# EAGLE design RH025_V2.1 (EAGLE 7.6.0)
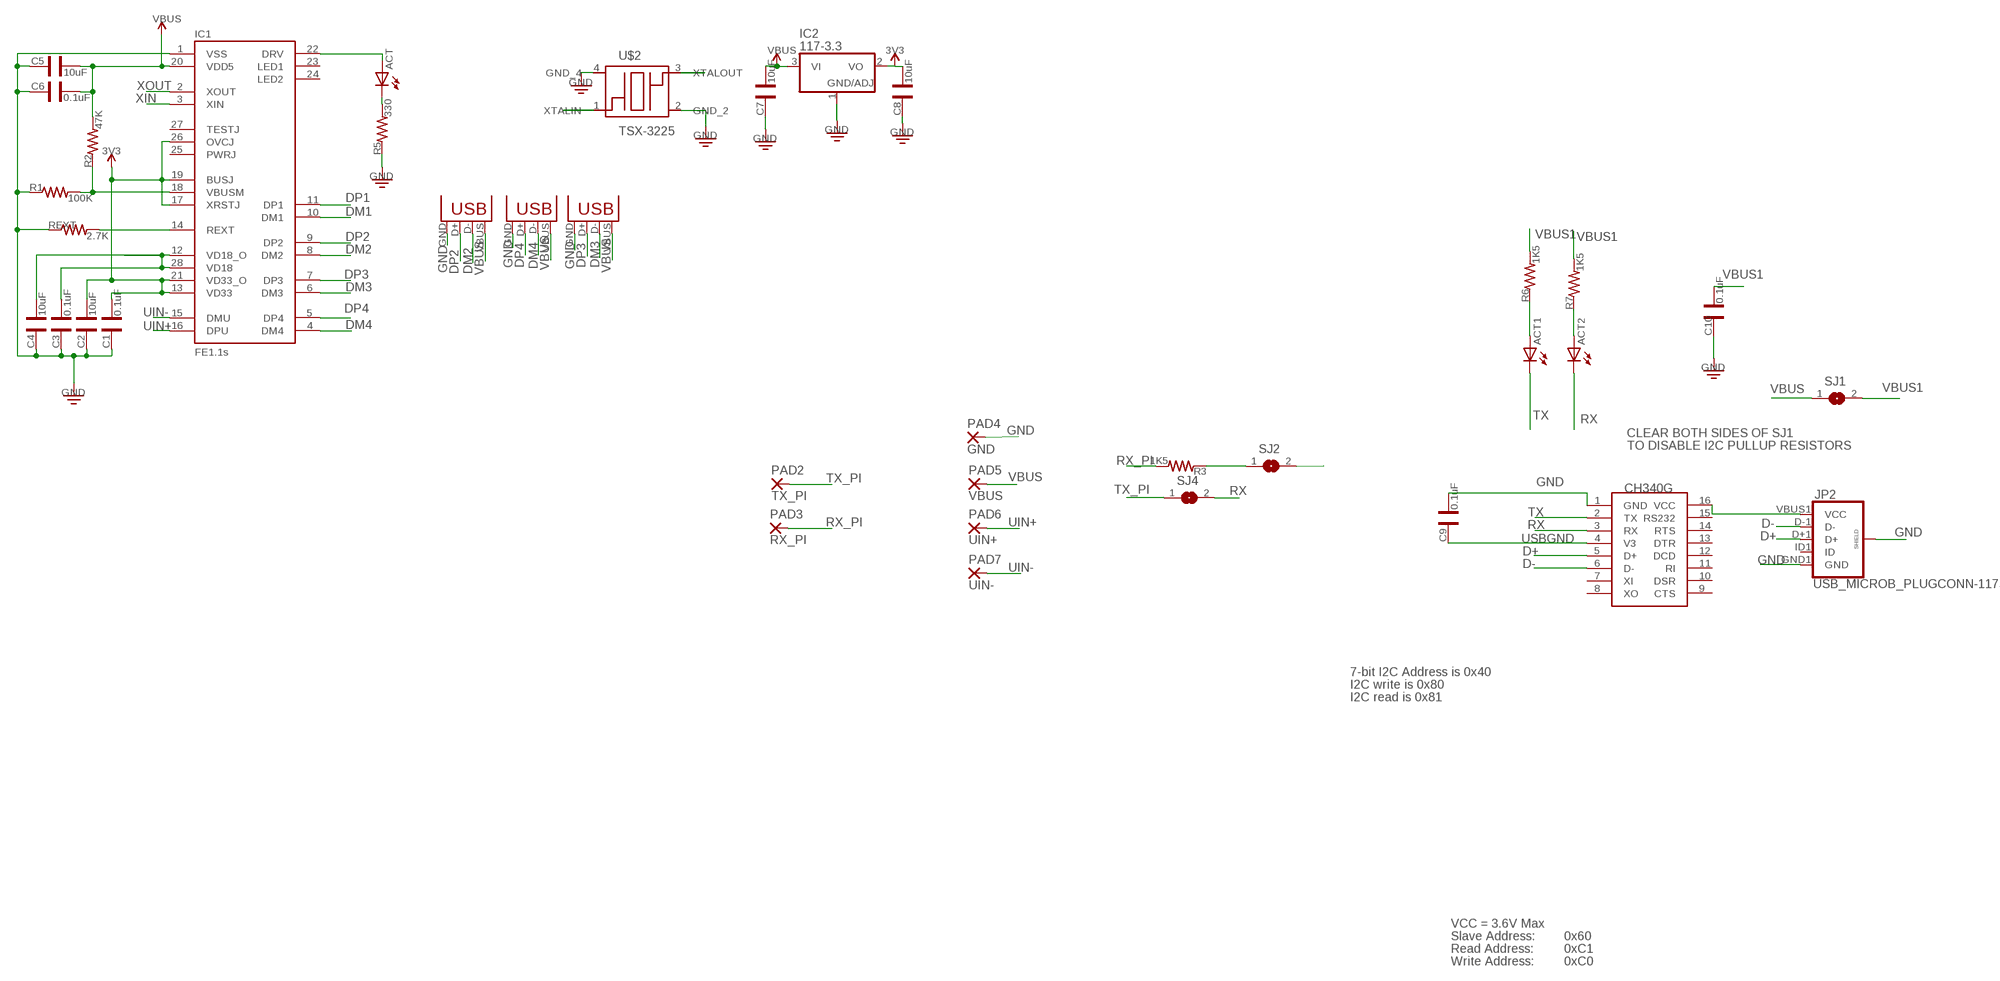
[diagram p0: schematic, sheet 1]

## Parts
ACT  LED0805  [LED-0805]
ACT1  LED0805  [LED-0805]
ACT2  LED0805  [LED-0805]
C1  0.1uF  CAP0805  [CAP-0805]
C2  10uF  CAP0805  [CAP-0805]
C3  0.1uF  CAP0805  [CAP-0805]
C4  10uF  CAP0805  [CAP-0805]
C5  10uF  CAP0805  [CAP-0805]
C6  0.1uF  CAP0805  [CAP-0805]
C7  10uF  CAP0805  [CAP-0805]
C8  10uF  CAP0805  [CAP-0805]
C9  0.1uF  CAP0805  [CAP-0805]
C10  0.1uF  CAP0805  [CAP-0805]
IC1  FE1.1S  [FE1.1S_SSOP-28]
IC2  117-3.3  1117-3.3EMP  [SOT223]
JP2  USB_MICROB_PLUGCONN-11752  [USB-B-MICRO-SMD_V03]
PAD2  TX_PI  WIREPAD2,15/1,0  [2,15/1,0]
PAD3  RX_PI  WIREPAD2,15/1,0  [2,15/1,0]
PAD4  GND  WIREPAD2,15/1,0  [2,15/1,0]
PAD5  VBUS  WIREPAD2,15/1,0  [2,15/1,0]
PAD6  UIN+  WIREPAD2,15/1,0  [2,15/1,0]
PAD7  UIN-  WIREPAD2,15/1,0  [2,15/1,0]
R1  100K  RES0805  [RES-0805]
R2  47K  RES0805  [RES-0805]
R3  1K5  RES0805  [RES-0805]
R5  330  RES0805  [RES-0805]
R6  1K5  RES0805  [RES-0805]
R7  1K5  RES0805  [RES-0805]
REXT  2.7K  RES0805  [RES-0805]
SJ1  SJ  [SJ]
SJ2  SJ  [SJ]
SJ4  SJ  [SJ]
U$2  TSX-3225  [TSX-3225]
U$8  CH340C  CH340G  [SOIC16]
USB2  USBA-PTH  [USB-A-F-PTH]
USB3  USBA-PTH  [USB-A-F-PTH]
USB4  USBA-PTH  [USB-A-F-PTH]

## Nets
3V3: C1.1 C2.1 C8.1 IC1.13(VD33) IC1.17(XRSTJ) IC1.19(BUSJ) IC1.21(VD33_O) IC1.26(OVCJ) IC2.2(VO)
D+: JP2.D+1(D+) U$8.5(D+)
D-: JP2.D-1(D-) U$8.6(D-)
DM1: IC1.10(DM1)
DM2: IC1.8(DM2) USB2.D-
DM3: IC1.6(DM3) USB3.D-
DM4: IC1.4(DM4) USB4.D-
DP1: IC1.11(DP1)
DP2: IC1.9(DP2) USB2.D+
DP3: IC1.7(DP3) USB3.D+
DP4: IC1.5(DP4) USB4.D+
GND: C1.2 C2.2 C3.2 C4.2 C5.2 C6.2 C7.2 C8.2 C9.1 C10.2 IC1.1(VSS) IC2.1(ADJ) JP2.GND1(GND) JP2.SHIELD1(SHIELD) JP2.SHIELD2(SHIELD) JP2.SHIELD3(SHIELD) PAD4.1(P) R1.1 R5.1 REXT.1 U$2.2(GND_2) U$2.4(GND_4) U$8.1(GND) USB2.GND USB3.GND USB4.GND
N$1: IC1.14(REXT) REXT.2
N$2: ACT2.A R7.1
N$3: ACT1.A R6.1
N$4: R3.1 SJ2.1
N$8: C3.1 C4.1 IC1.12(VD18_O) IC1.28(VD18)
N$13: IC1.18(VBUSM) R1.2 R2.1
N$22: ACT.C R5.2
N$25: ACT.A IC1.22(DRV)
RX: ACT2.C SJ4.2 U$8.3(RX)
RX_PI: PAD3.1(P) R3.2
TX: ACT1.C SJ2.2 U$8.2(TX)
TX_PI: PAD2.1(P) SJ4.1
UIN+: IC1.16(DPU) PAD6.1(P)
UIN-: IC1.15(DMU) PAD7.1(P)
USBGND: C9.2 U$8.4(V3)
VBUS: C5.1 C6.1 C7.1 IC1.20(VDD5) IC2.3(VI) PAD5.1(P) R2.2 SJ1.1 USB2.VBUS USB3.VBUS USB4.VBUS
VBUS1: C10.1 JP2.VBUS1(VCC) R6.2 R7.2 SJ1.2 U$8.16(VCC)
XIN: IC1.3(XIN) U$2.1(XTALIN)
XOUT: IC1.2(XOUT) U$2.3(XTALOUT)
Unconnected: IC1.23(LED1) IC1.24(LED2) IC1.25(PWRJ) IC1.27(TESTJ) JP2.ID1(ID) U$8.7(XI) U$8.8(XO) U$8.9(CTS) U$8.10(DSR) U$8.11(RI) U$8.12(DCD) U$8.13(DTR) U$8.14(RTS) U$8.15(RS232)

## Notes on the sheet
- CLEAR BOTH SIDES OF SJ1
- TO DISABLE I2C PULLUP RESISTORS
- 7-bit I2C Address is 0x40
- I2C write is 0x80
- I2C read is 0x81
- VCC = 3.6V Max
- Slave Address: | 0x60
- Read Address: | 0xC1
- Write Address: | 0xC0

## Library data of the parts
ACT ACT1 ACT2 = Ai_LED:LED
C1-C10 = Ai_Passives:CAP
IC1 = Ai_IC:FE1.1S
IC2 = linear:1117-3.3: Positive VOLTAGE REGULATOR
JP2 = SparkFun-Connectors:USB_MICROB_PLUG: USB Micro-B connectors Some male, some female. Watch your step!; PROD_ID: CONN-11752
PAD2-PAD7 = wirepad:WIREPAD: Wire PAD connect wire on PCB
R1-R3 R5-R7 REXT = Ai_Passives:RES: Part # blah Digikey
SJ1 SJ2 SJ4 = jumper:SJ: SMD solder JUMPER
U$2 = crystals:TSX-3225
U$8 = ch340g:CH340G
USB2-USB4 = Ai_Connectors:USB

## Net classes
0 default: clearance 0.205 mm
1 power: width 0.381 mm, clearance 0.254 mm

## Board
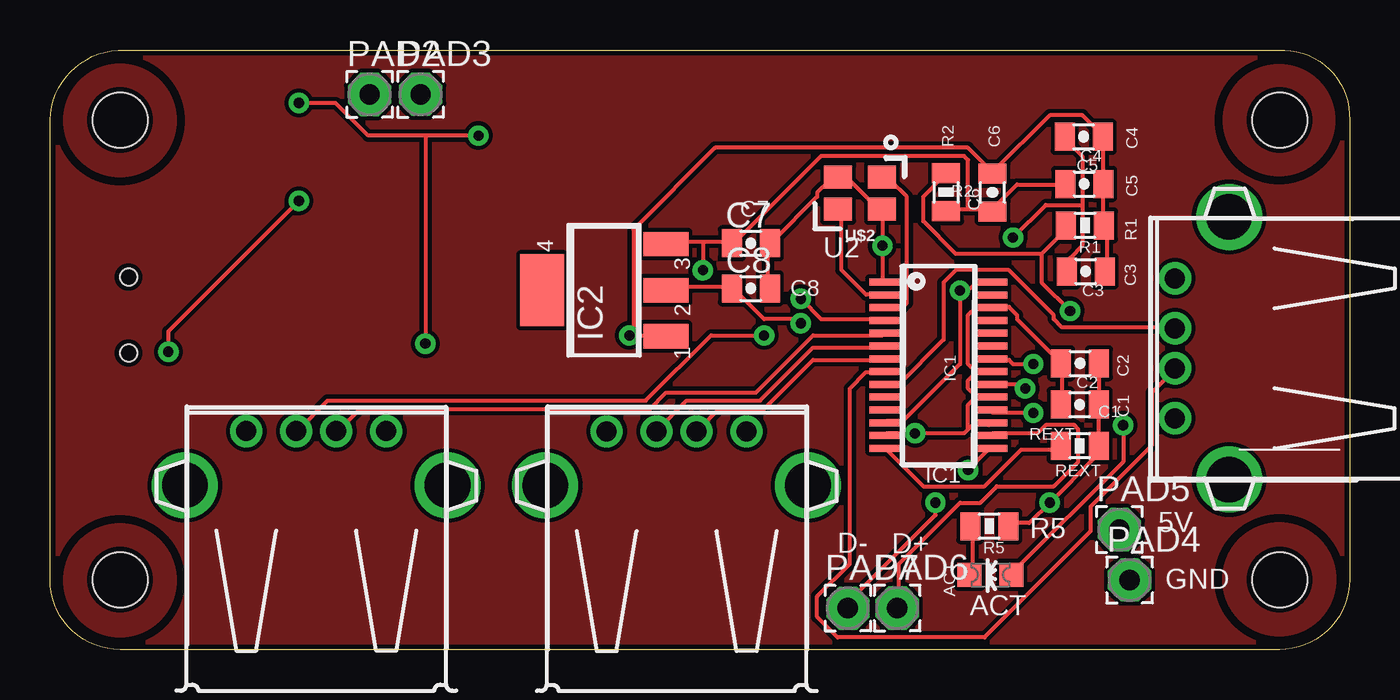
[diagram p1: board, top side]
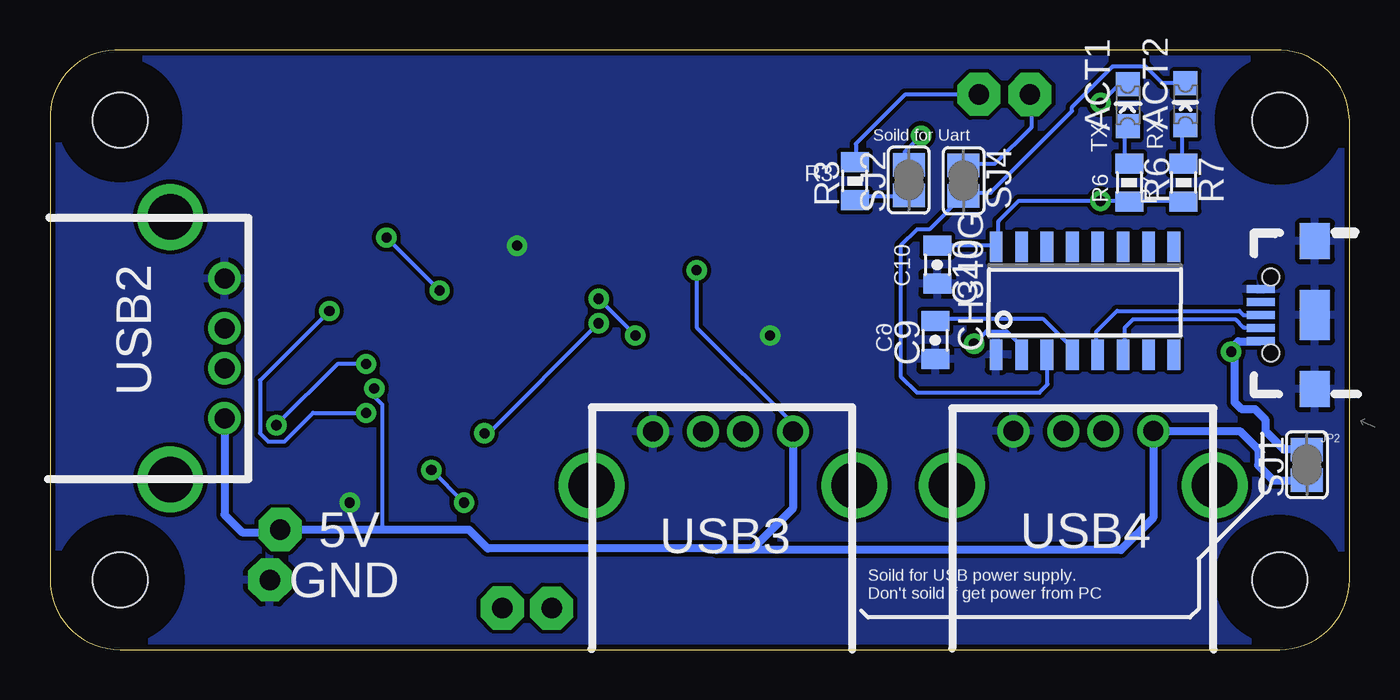
[diagram p2: board, bottom side, seen from below]

Size 65 x 30 mm. Coordinates in mm from the lower left corner, seen from the top.
Outline: 0,3.5 0,26.5 arc-90 3.75,30 61.75,30 arc-90 65,26.5 65,3.5 arc-90 61.5,0 3.5,0 arc-90 0,3.5
Copper layers (1*16): Top 0.035mm / dielectric 1.5mm / Bottom 0.035mm
Design rules "SparkFun": minimum track width 8mil, minimum drill 20mil, track to track 8mil, track to pad 8mil, pad to pad 8mil, via to via 8mil, smd to smd 8mil, copper to edge 10mil, drill to drill 8mil, minimum pad ring 12mil, minimum via ring 10mil, stop-mask expansion 4mil, vias tented up to drill 25mil, thermal gap 10mil
Holes 2.75 mm at 3.5,3.5 61.5,3.5 3.5,26.5 61.5,26.5
tRestrict: area 58.5,23.5 to 64.5,29.5; area 0.5,23.4 to 6.5,29.5; area 0.5,0.4 to 6.5,6.5; area 58.4,0.5 to 64.5,6.6
bRestrict: area 0.5,0.5 to 6.5,6.5; area 0.5,23.5 to 6.5,29.5; area 58.6,23.6 to 64.4,29.4; area 58.5,0.5 to 64.5,6.5; area 58.6,23.6 to 64.4,29.4; area 0.5,23.5 to 6.5,29.5

### Footprints (pad centres in the part's own frame; a part is rotated, then mirrored left to right if it is on the bottom)
LED-0805 = smd 1.2 x 1.2: A 0,-1.05; C 0,1.05
CAP-0805 = smd 1 x 1.4: 1 -0.95,0; 2 0.95,0
FE1.1S_SSOP-28 = smd 0.35 x 1.5: 1 -4.16,-2.7; 2 -3.52,-2.7; 3 -2.88,-2.7; 4 -2.24,-2.7; 5 -1.6,-2.7; 6 -0.96,-2.7; 7 -0.32,-2.7; 8 0.32,-2.7; 9 0.96,-2.7; 10 1.6,-2.7; 11 2.24,-2.7; 12 2.88,-2.7; 13 3.52,-2.7; 14 4.16,-2.7; 15 4.16,2.7; 16 3.52,2.7; 17 2.88,2.7; 18 2.24,2.7; 19 1.6,2.7; 20 0.96,2.7; 21 0.32,2.7; 22 -0.3,2.7; 23 -0.96,2.7; 24 -1.6,2.7; 25 -2.24,2.7; 26 -2.88,2.7; 27 -3.52,2.7; 28 -4.16,2.7
SOT223 = smd 1.219 x 2.235: 1 -2.311,-3.099; 2 0,-3.099; 3 2.311,-3.099 | smd 3.6 x 2.2: 4 0,3.099
USB-B-MICRO-SMD_V03 = smd 1.4 x 0.4: D+1 2.7,0; D-1 2.7,0.65; GND1 2.7,-1.3; ID1 2.7,-0.65; VBUS1 2.7,1.3 | smd 1.5 x 1.8: SHIELD1 0,3.7; SHIELD2 0,-3.7 | smd 1.5 x 2.5: SHIELD3 0,0 | hole 0.85: 2.2,1.9; 2.2,-1.9
2,15/1,0 = drill 1.016 pad 2.159 octagon: 1 0,0
RES-0805 = smd 1 x 1.4: 1 -0.95,0; 2 0.95,0
SJ = smd 1.168 x 1.6: 1 -0.762,0; 2 0.762,0
TSX-3225 = smd 1.4 x 1.15: 1 0,-1.6; 2 2.2,-1.6; 3 2.2,0; 4 0,0
SOIC16 = smd 0.635 x 1.524: 1 -4.445,-2.695; 2 -3.175,-2.695; 3 -1.905,-2.695; 4 -0.635,-2.695; 5 0.635,-2.695; 6 1.905,-2.695; 7 3.175,-2.695; 8 4.445,-2.695; 9 4.445,2.695; 10 3.175,2.695; 11 1.905,2.695; 12 0.635,2.695; 13 -0.635,2.695; 14 -1.905,2.695; 15 -3.175,2.695; 16 -4.445,2.695
USB-A-F-PTH = drill 1: D+ 1,5.37; D- -1,5.37; GND 3.5,5.37; VBUS -3.5,5.37 | drill 2.286: P$1 -6.57,2.66; P$2 6.57,2.66

### Placement (x,y rotation side)
ACT  47.04,3.74 90 top
ACT1  11.1,27.23 0 bottom
ACT2  8.2,27.28 0 bottom
C1  51.51,12.26 0 top
C2  51.51,14.32 0 top
C3  51.81,18.92 0 top
C4  51.71,25.66 0 top
C5  51.73,23.29 0 top
C6  47.14,22.87 90 top
C7  35.05,20.33 0 top
C8  35.06,18.07 0 top
C9  20.72,15.48 90 bottom
C10  20.62,19.25 270 bottom
IC1  44.43,14.23 270 top
IC2  27.71,17.98 90 top
JP2  1.73,16.74 180 bottom
PAD2  15.99,27.78 0 top
PAD3  18.53,27.78 0 top
PAD4  54,3.48 0 top
PAD5  53.49,6 0 top
PAD6  42.38,2.08 0 top
PAD7  39.91,2.07 0 top
R1  51.77,21.22 180 top
R2  44.81,22.89 270 top
R3  24.74,23.44 90 bottom
R5  46.99,6.17 180 top
R6  11.02,23.37 270 bottom
R7  8.31,23.37 270 bottom
REXT  51.5,10.19 180 top
SJ1  2.13,9.25 90 bottom
SJ2  22.05,23.5 90 bottom
SJ4  19.31,23.46 270 bottom
U$2  41.62,22.03 180 top
U$8  13.23,17.45 0 bottom
USB2  61.64,15.07 90 top
USB3  31.34,5.55 0 top
USB4  13.32,5.56 0 top

### Tracks (layer width: path | path; a pad name or v marks a point on that pad's centre or on a via)
3V3  (via drill 0.51)
  Top 0.203: IC2.2 30.82,18.16 34.09,18.16 C8.1 34.29,17.96 35.72,16.53 37.35,16.53 v37.55,16.33 | C1.1 50.62,12.45 50.62,14.29 C2.1 50.41,14.49 48.37,16.53 48.37,16.74 47.96,17.14 47.15,17.14 IC1.26 46.94,17.14 46.33,17.14 45.92,16.74 45.92,14.29 46.33,13.88 | 45.92,11.02 46.13,11.23 46.94,11.23 IC1.17 | 45.92,11.02 45.72,10.82 v43.27,10.82 41.84,10.82 IC1.13 | 46.33,12.65 46.94,12.65 IC1.19 | 46.33,12.65 45.92,12.25 45.92,11.02 | 46.33,13.88 46.94,13.88 IC1.21 | 46.33,13.88 45.92,13.47 45.92,13.06 46.33,12.65
  Bottom 0.203: v37.55,16.33 43.06,10.82 v43.27,10.82
D+
  Bottom 0.203: JP2.D+1 4.49,16.74 5.31,16.74 5.51,16.94 11.63,16.94 12.65,15.92 12.65,14.9 U$8.5
D-
  Bottom 0.203: JP2.D-1 4.49,16.12 5.31,16.12 5.71,16.53 10.82,16.53 11.23,16.12 11.23,14.9 U$8.6
DM2
  Top 0.203: IC1.8 41.64,13.88 40.82,13.88 40,13.06 40,4.29 38.37,2.65 38.37,1.63 39.39,0.61 46.74,0.61 52.05,5.92 52.05,7.14 55.11,10.21 55.11,12.86 56.13,13.88 USB2.D-
DM3
  Top 0.203: IC1.6 41.64,15.1 38.17,15.1 35.51,12.45 31.84,12.45 30.41,11.02 USB3.D-
DM4  (via drill 0.51)
  Top 0.203: v37.55,17.55 38.58,16.53 41.64,16.53 IC1.4 | v35.72,15.72 33.06,15.72 29.8,12.45 13.88,12.45 12.45,11.02 USB4.D-
  Bottom 0.203: v35.72,15.72 v37.55,17.55
DP2
  Top 0.203: IC1.9 41.84,13.27 42.45,13.27 44.7,15.51 44.7,18.37 45.31,18.98 47.96,18.98 50.21,16.74 50.21,16.53 50.62,16.12 56.13,16.12 USB2.D+
DP3
  Top 0.203: IC1.7 41.64,14.49 38.17,14.49 35.72,12.04 33.47,12.04 32.45,11.02 USB3.D+
DP4
  Top 0.203: IC1.5 41.64,15.72 38.17,15.72 35.31,12.86 30.82,12.86 30,12.04 15.51,12.04 14.49,11.02 USB4.D+
GND  (via drill 0.51)
  Top 0.203: C2.2 52.45,14.29 52.45,12.45 C1.2 52.45,12.25 52.45,10.21 REXT.1 52.25,10 52.25,9.59 v50.01,7.35 48.98,6.33 47.96,6.33 R5.1 | C8.2 35.92,18.16 35.92,20.21 C7.2 36.13,20.41 38.37,22.66 38.37,22.86 38.98,23.47 39.39,23.47 U$2.2 39.59,23.47 40,23.47 41.43,22.04 U$2.4 41.64,21.84 v41.64,20.21 41.64,18.37 IC1.1 | 29.19,15.72 30.61,15.72 IC2.1 | 47.15,23.88 50.01,26.74 51.64,26.74 52.66,25.72 C4.2 52.66,25.51 52.66,23.47 C5.2 52.66,23.27 52.66,21.23 R1.1 52.86,21.02 52.86,18.98 C3.2 | 29.19,15.72 29.19,21.02 33.27,25.1 45.92,25.1 47.15,23.88 | 29.19,15.72 v28.98,15.72 | 47.15,23.88 C6.2
  pour Bottom: 0,25 0,5 arc90 5,0 60,0 arc90 65,5 65,25 arc90 60,30 5,30 arc90
N$1
  Top 0.203: REXT.2 50.41,10 48.58,10 46.74,8.16 43.68,8.16 41.84,10 IC1.14
N$2
  Bottom 0.203: ACT2.A 8.37,26.12 8.37,24.49 R7.1
N$3
  Bottom 0.203: ACT1.A 11.23,26.12 11.23,24.49 R6.1
N$4
  Bottom 0.203: R3.1 24.7,22.66 22.25,22.66 SJ2.1
N$5
  pour Top (no thermals): 65.02,24.97 65.02,5 arc-90 60.02,0 5,0 arc-90 0,5 0,24.97 arc-90 5,29.97 60.02,29.97 arc-90
N$8  (via drill 0.51)
  Top 0.203: 51.64,22.25 51.64,24.7 50.82,25.51 C4.1 | 51.64,22.25 51.64,20.21 51.02,19.59 51.02,18.98 C3.1 | 45.72,17.76 46.33,18.37 46.94,18.37 IC1.28 | 45.72,17.76 45.51,17.55 45.51,14.29 42.66,11.43 41.84,11.43 IC1.12 | 51.64,22.25 49.8,22.25 v48.17,20.61 | 45.72,17.76 v45.51,17.96
  Bottom 0.203: v45.51,17.96 v48.17,20.61
N$13  (via drill 0.51)
  Top 0.203: 49.6,19.8 45.31,19.8 43.68,21.43 43.68,22.66 44.7,23.68 R2.1 | 49.6,19.8 50.82,21.02 R1.2 | v49.19,11.84 47.15,11.84 IC1.18 | v51.02,16.94 49.6,18.37 49.6,19.8
  Bottom 0.203: v49.19,11.84 51.84,11.84 53.27,10.41 54.09,10.41 54.49,10.82 54.49,13.47 v51.02,16.94
N$22
  Top 0.203: ACT.C 46.13,3.88 46.13,6.12 R5.2
N$25  (via drill 0.51)
  Top 0.203: v53.68,11.23 53.68,9.39 48.17,3.88 ACT.A | v49.19,14.29 48.17,14.29 47.96,14.49 47.15,14.49 IC1.22
  Bottom 0.203: v53.68,11.23 50.62,14.29 v49.19,14.29
RX
  Bottom 0.203: ACT2.C 8.37,28.37 9.39,28.37 10.21,29.19 11.84,29.19 13.88,27.14 13.88,26.94 17.96,22.86 19.18,22.86 SJ4.2 19.39,22.66 21.02,21.02 21.64,21.02 22.45,20.21 22.45,13.68 21.64,12.86 15.51,12.86 15.1,13.27 15.1,14.7 U$8.3
RX_PI
  Bottom 0.203: R3.2 24.7,24.49 24.7,25.31 22.25,27.76 18.57,27.76 PAD3.1
TX  (via drill 0.51)
  Top 0.203: v12.45,27.35 14.29,27.35 15.92,25.72 18.78,25.72 | v21.43,25.72 18.78,25.72 | 18.78,25.72 v18.78,15.31
  Bottom 0.203: v12.45,27.35 11.63,28.17 11.23,28.17 ACT1.C | v21.43,25.72 22.25,24.9 22.25,24.29 SJ2.2 | v18.78,15.31 18.16,15.92 17.14,15.92 16.53,15.31 16.53,14.9 U$8.2
TX_PI
  Bottom 0.203: SJ4.1 19.18,24.29 17.76,24.29 15.92,26.12 15.92,27.76 PAD2.1
UIN+
  Top 0.203: IC1.16 47.15,10.82 49.39,10.82 49.8,11.23 51.23,11.23 51.43,11.02 51.43,9.39 50.21,8.16 47.35,8.16 46.53,7.35 45.51,7.35 42.45,4.29 42.45,2.25 PAD6.1
UIN-  (via drill 0.51)
  Top 0.203: v45.92,8.98 46.94,10 IC1.15 | v44.29,7.35 44.29,6.74 39.8,2.25 PAD7.1
  Bottom 0.203: v44.29,7.35 v45.92,8.98
USBGND
  Bottom 0.203: C9.2 20.61,16.53 15.31,16.53 13.68,14.9 U$8.4
VBUS  (via drill 0.51)
  Top 0.203: v48.78,13.06 48.58,13.27 47.15,13.27 IC1.20 | 32.66,20.41 30.82,20.41 IC2.3 | 32.66,20.41 34.09,20.41 C7.1 34.29,20.41 38.58,24.7 45.72,24.7 45.92,24.49 45.92,22.04 | 45.92,22.04 44.9,22.04 R2.2 | 45.92,22.04 46.94,22.04 C6.1 47.15,22.04 48.37,23.27 50.62,23.27 C5.1 | 32.66,20.41 v32.66,18.98
  Bottom 0.203: v48.78,13.06 48.78,12.65 48.37,12.25 48.37,5.99 | v32.66,18.98 32.66,16.12 27.96,11.43 27.96,11.02 USB3.VBUS
  Bottom 0.406: USB2.VBUS 56.27,6.74 55.4,5.87 53.62,5.87 PAD5.1 53.48,5.99 48.37,5.99 44.04,5.99 43.1,5.05 31.73,5.05 | USB3.VBUS 27.84,7.06 29.84,5.05 31.73,5.05 | 31.73,5.05 31.65,4.98 11.43,4.98 9.82,6.59 USB4.VBUS 5.49,10.93 4.57,10.01 4.57,9.22 3.81,8.46 2.16,8.46 SJ1.1
VBUS1  (via drill 0.51)
  Top 0.203: v5.92,14.9 5.92,15.92 v12.45,22.45
  Bottom 0.203: R7.2 8.37,22.45 11.02,22.45 R6.2 11.23,22.45 v12.45,22.45 16.53,22.45 17.55,21.43 17.55,20.21 U$8.16 17.76,20.21 C10.1 | v5.92,14.9 5.74,14.9
  Bottom 0.406: SJ1.2 3.28,10.01 4.19,10.92 4.19,11.48 4.72,12.01 5.38,12.01 5.74,12.37 5.74,14.9 5.74,15.24 5.56,15.42 4.45,15.42 JP2.VBUS1
XIN
  Top 0.203: U$2.1 41.64,23.47 42.05,23.47 42.86,22.66 42.86,17.35 42.66,17.14 41.84,17.14 IC1.3
XOUT
  Top 0.203: U$2.3 39.59,21.84 39.59,18.98 40.82,17.76 41.64,17.76 IC1.2

### Text on the board
tDocu: REG
_tsilk: R2 | C6 | C4 | C5 | C7 | U2 | R1 | C8 | C3 | C2 | IC1 | C1 | REXT | R5 | 5V | D- | D+ | GND | ACT
_bNames: RX | TX | Soild for Uart | R3 | R7 | R6 | C10 | C9 | USB2 | USB4 | USB3 | 5V | GND | Soild for USB power supply. / Don't soild if get power from PC